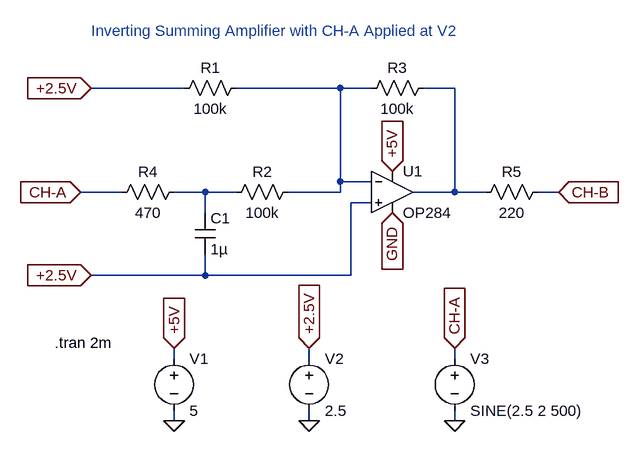
[diagram p0: schematic inv_sum_amp_with_ch-a_v2_ltspice.asc]
inv_sum_amp_with_ch-a_v2_ltspice.asc, the LTspice schematic file:
Version 4
SHEET 1 880 776
WIRE -176 128 -320 128
WIRE 64 128 -96 128
WIRE 112 128 64 128
WIRE 240 128 192 128
WIRE 64 272 64 128
WIRE 112 272 64 272
WIRE -272 288 -336 288
WIRE -144 288 -192 288
WIRE -96 288 -144 288
WIRE 64 288 64 272
WIRE 64 288 -16 288
WIRE 240 288 240 128
WIRE 240 288 176 288
WIRE 288 288 240 288
WIRE 400 288 368 288
WIRE 112 304 80 304
WIRE -144 320 -144 288
WIRE -144 416 -144 384
WIRE -144 416 -320 416
WIRE 80 416 80 304
WIRE 80 416 -144 416
WIRE -192 544 -192 528
WIRE 16 544 16 528
WIRE 240 544 240 528
WIRE -192 640 -192 624
WIRE 16 640 16 624
WIRE 240 640 240 624
FLAG 144 256 +5V
IOPIN 144 256 In
FLAG 144 320 GND
IOPIN 144 320 In
FLAG -336 288 CH-A
IOPIN -336 288 In
FLAG -320 416 +2.5V
IOPIN -320 416 In
FLAG 400 288 CH-B
IOPIN 400 288 In
FLAG -192 640 0
FLAG 16 640 0
FLAG 240 640 0
FLAG -192 528 +5V
IOPIN -192 528 In
FLAG 16 528 +2.5V
IOPIN 16 528 In
FLAG 240 528 CH-A
IOPIN 240 528 In
FLAG -320 128 +2.5V
IOPIN -320 128 In
SYMBOL Opamps\\OP284 144 224 R0
SYMATTR InstName U1
SYMBOL res -80 112 R90
WINDOW 0 0 56 VBottom 2
WINDOW 3 32 56 VTop 2
SYMATTR InstName R1
SYMATTR Value 100k
SYMBOL res 0 272 R90
WINDOW 0 0 56 VBottom 2
WINDOW 3 32 56 VTop 2
SYMATTR InstName R2
SYMATTR Value 100k
SYMBOL res 208 112 R90
WINDOW 0 0 56 VBottom 2
WINDOW 3 32 56 VTop 2
SYMATTR InstName R3
SYMATTR Value 100k
SYMBOL res -176 272 R90
WINDOW 0 0 56 VBottom 2
WINDOW 3 32 56 VTop 2
SYMATTR InstName R4
SYMATTR Value 470
SYMBOL res 384 272 R90
WINDOW 0 0 56 VBottom 2
WINDOW 3 32 56 VTop 2
SYMATTR InstName R5
SYMATTR Value 220
SYMBOL cap -160 320 R0
SYMATTR InstName C1
SYMATTR Value 1µ
SYMBOL voltage -192 528 R0
SYMATTR InstName V1
SYMATTR Value 5
SYMBOL voltage 16 528 R0
SYMATTR InstName V2
SYMATTR Value 2.5
SYMBOL voltage 240 528 R0
WINDOW 123 0 0 Left 0
WINDOW 39 0 0 Left 0
SYMATTR InstName V3
SYMATTR Value SINE(2.5 2 500)
TEXT -320 40 Left 2 ;Inverting Summing Amplifier with CH-A Applied at V2
TEXT -376 520 Left 2 !.tran 2m

The netlist it stands for:
* inv_sum_amp_with_ch-a_v2_ltspice.asc
XU1 +2.5V N001 +5V GND N002 OP284  ; pins In+ In- V+ V- OUT
R1 N001 +2.5V 100k
R2 N001 N003 100k
R3 N002 N001 100k
R4 N003 CH-A 470
R5 CH-B N002 220
C1 N003 +2.5V 1µ
V1 +5V 0 5
V2 +2.5V 0 2.5
V3 CH-A 0 SINE(2.5 2 500)
* Inverting Summing Amplifier with CH-A Applied at V2
.tran 2m
.lib ADI1.lib
.backanno
.end